# EAGLE design BUZZER (EAGLE 9.6.2)
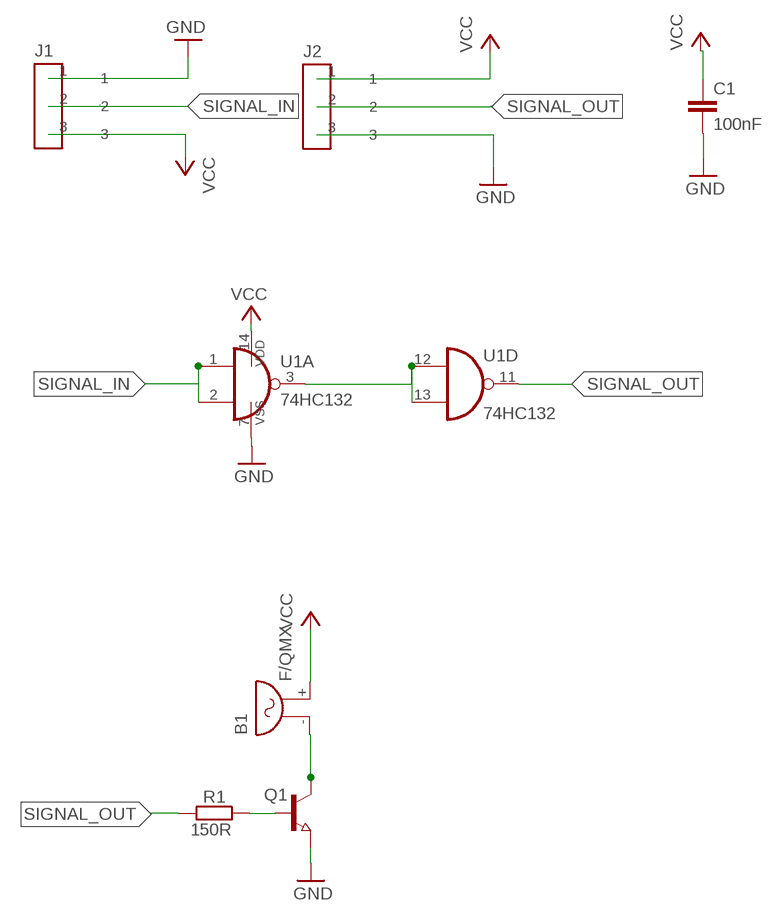
[diagram p0: schematic, sheet 1]

## Parts
B1  F/QMX  [F/QMX]
C1  100nF  C-EUC0805  [C0805]
J1  CONECTOR_MACHO  [MALE]
J2  CONECTOR_FEMEA  [FEMALE]
Q1  BC817  NPN-TRANSISTOR_SOT23  [SOT23]
R1  150R  R-EU_R0805W  [R0805W]
U1  74HC132  4011D  [SO14]

## Nets
GND: C1.2 J1.1 J2.3 Q1.2(E) U1.7(P:VSS)
N$1: U1.3(A:O) U1.12(D:I0) U1.13(D:I1)
N$2: Q1.1(B) R1.1
N$4: B1.- Q1.3(C)
SIGNAL_IN: J1.2 U1.1(A:I0) U1.2(A:I1)
SIGNAL_OUT: J2.2 R1.2 U1.11(D:O)
VCC: B1.+ C1.1 J1.3 J2.1 U1.14(P:VDD)
Unconnected: U1.4(B:O) U1.5(B:I0) U1.6(B:I1) U1.8(C:I0) U1.9(C:I1) U1.10(C:O)

## Library data of the parts
B1 = buzzer:F/QMX: BUZZER Source: Buerklin; OC_FARNELL: unknown; OC_NEWARK: unknown
C1 = rcl:C-EU: CAPACITOR, European symbol; SPICEPREFIX: C
J1 = Eletroblocks Lib:CONECTOR_MACHO
J2 = Eletroblocks Lib:CONECTOR_FEMEA
Q1 = semicon-smd-ipc:NPN-TRANSISTOR_: NPN TRANSISTOR
R1 = rcl:R-EU_: RESISTOR, European symbol; SPICEPREFIX: R
U1 = 40xx:4011: Quad 2-input NAND

## Board
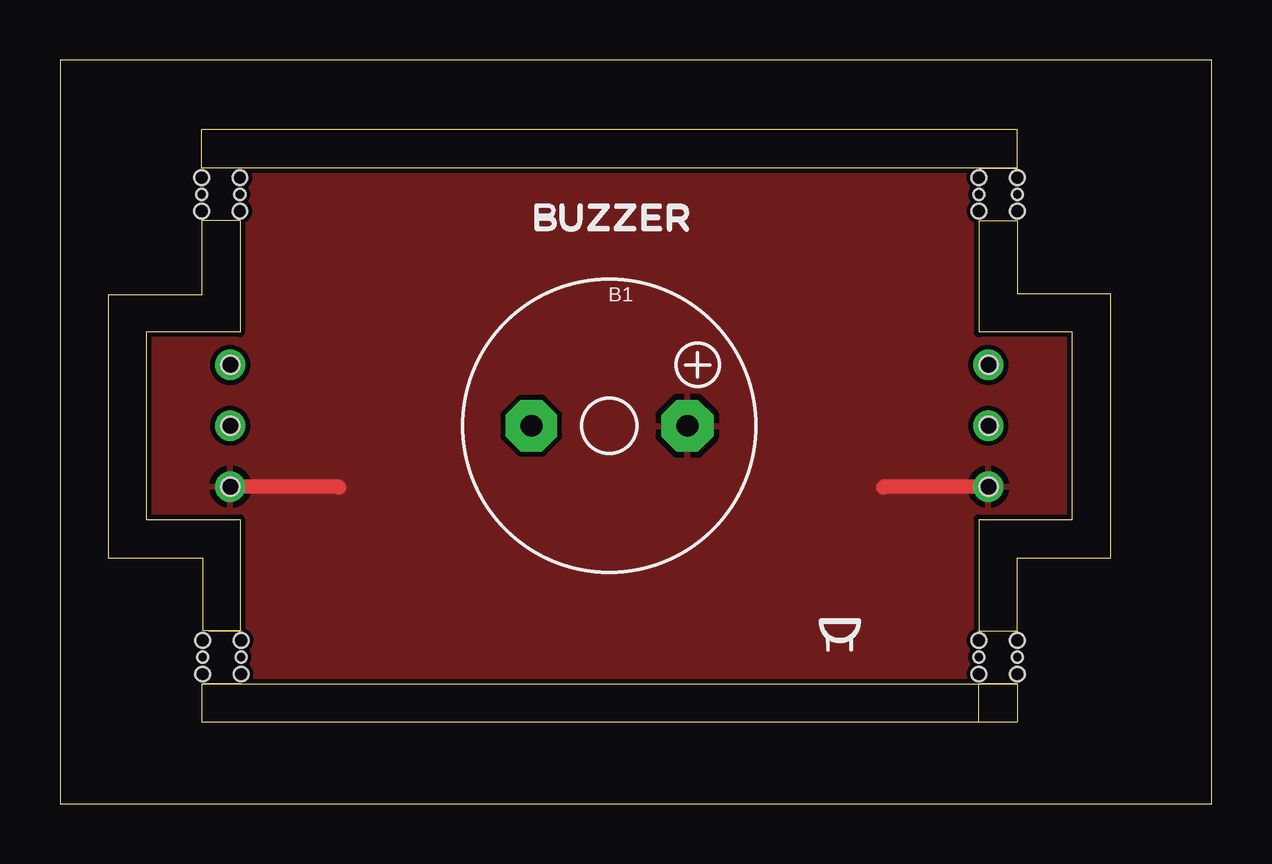
[diagram p1: board, top side]
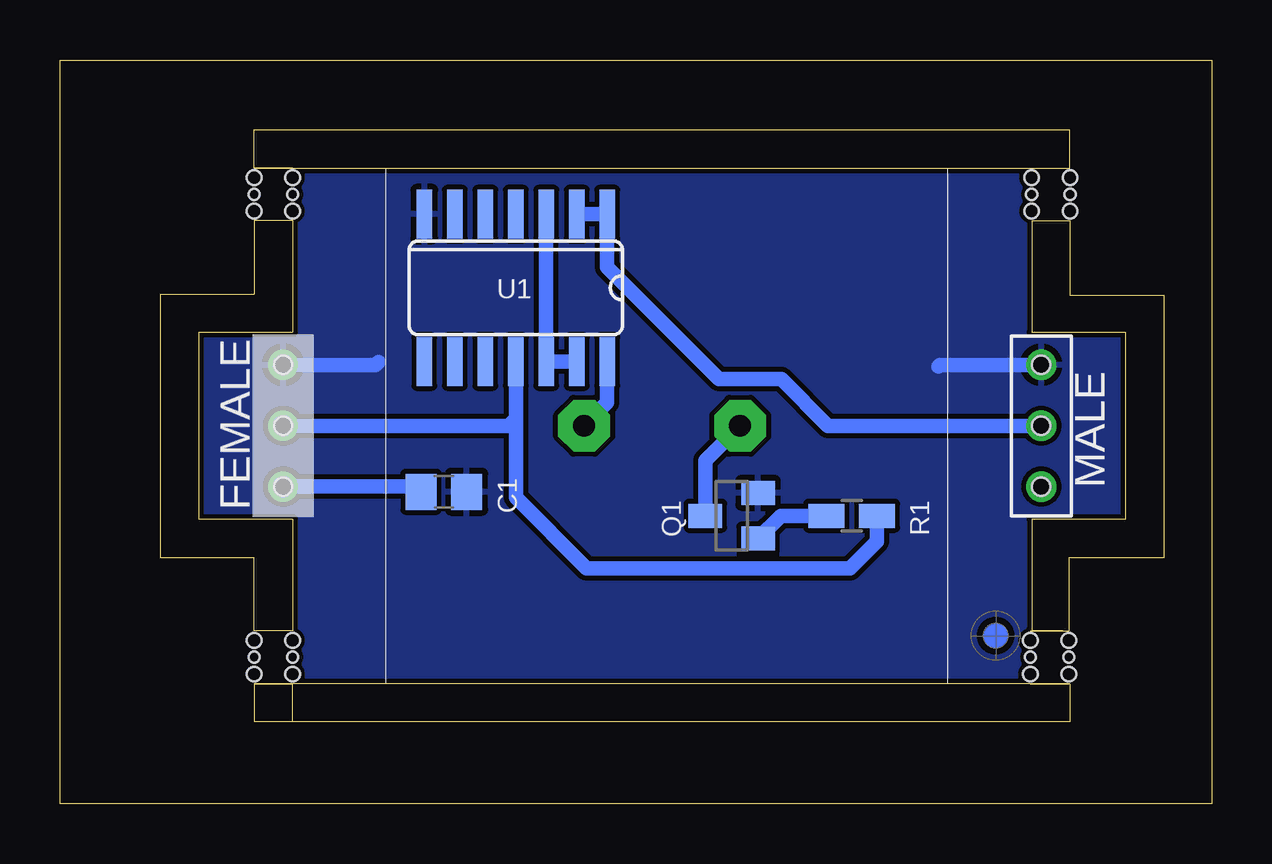
[diagram p2: board, bottom side, seen from below]

Size 48 x 31 mm. Coordinates in mm from the lower left corner, seen from the top.
Outline: 38.3,5 5.9,5 5.9,3.4 39.9,3.4 39.9,5 38.3,5
Outline: 38.3,3.4 38.3,5
Outline: 38.3,7.2 38.3,11.85 42.2,11.85 42.2,19.65 38.3,19.65 38.3,24.3
Outline: 39.9,7.2 39.9,10.25 43.8,10.25 43.8,21.25 39.9,21.25 39.9,24.3
Outline: 39.9,26.5 5.9,26.5 5.9,28.1 39.9,28.1 39.9,26.5
Outline: 7.5,19.65 3.6,19.65 3.6,11.85 7.5,11.85 7.5,7.2 6.2,7.2 5.95,7.2 5.95,10.25 2,10.25 2,21.2 5.9,21.2 5.9,24.3 7.5,24.3 7.5,19.65
Outline: 0,31 0,0 48,0 48,31 0,31
Copper layers (1*16): Top 0.035mm / dielectric 1.5mm / Bottom 0.035mm
Design rules "default *": minimum track width 8mil, minimum drill 0.35mm, track to track 8mil, track to pad 8mil, pad to pad 8mil, via to via 8mil, smd to smd 8mil, copper to edge 8mil, drill to drill 8mil, minimum pad ring 10mil, minimum via ring 8mil, stop-mask expansion 4mil, vias tented up to drill 0mil, thermal gap 10mil

### Footprints (pad centres in the part's own frame; a part is rotated, then mirrored left to right if it is on the bottom)
F/QMX = drill 0.914 pad 2.159 octagon: + 3.251,0; - -3.251,0
C0805 = smd 1.3 x 1.5: 1 -0.95,0; 2 0.95,0
MALE = drill 0.75: 1 0,2.54; 2 0,0; 3 0,-2.54 | hole 0.75: 0,2.54; 0,0; 0,-2.54
FEMALE = drill 0.75: 1 0,2.54; 2 0,0; 3 0,-2.54 | hole 0.75: 0,2.54; 0,0; 0,-2.54
SOT23 = smd 1 x 1.4: 1 -0.95,-1.1; 2 0.95,-1.1; 3 0,1.1
R0805W = smd 1.5 x 1: 1 -1.052,0; 2 1.052,0
SO14 = smd 0.66 x 2.032: 1 -3.81,-3.073; 2 -2.54,-3.073; 3 -1.27,-3.073; 4 0,-3.073; 5 1.27,-3.073; 6 2.54,-3.073; 7 3.81,-3.073; 8 3.81,3.073; 9 2.54,3.073; 10 1.27,3.073; 11 0,3.073; 12 -1.27,3.073; 13 -2.54,3.073; 14 -3.81,3.073
STAMP_DUPLO = hole 0.45: 0,0; 0,-1.6 | hole 0.6: 0.7,0; -0.7,0; 0.7,-1.6; -0.7,-1.6

### Placement (x,y rotation side)
B1  22.9,15.75 0 top
C1  32,13 0 bottom
J1  7.1,15.75 0 top
J2  38.7,15.75 180 top
Q1  20,12 90 bottom
R1  15,12 0 bottom
U1  29,21.5 180 bottom
U$1  [FIDUCIAL_G10]  9,7 0 bottom
U$2  [STAMP_DUPLO]  7.55,6.1 270 top
U$3  [STAMP_DUPLO]  38.3,6.1 90 top
U$4  [STAMP_DUPLO]  38.3,25.4 90 top
U$5  [STAMP_DUPLO]  7.5,25.4 270 top

### Tracks (layer width: path | path; a pad name or v marks a point on that pad's centre or on a via)
GND
  Bottom 0.61: J1.1 11.33,18.29 11.39,18.23 | J2.3 34.84,18.29 34.72,18.41
  pour Bottom: 2.9,5 42.87,5 42.87,26.5 2.9,26.5
N$1
  Bottom 0.61: U1.3 U1.12 U1.13
N$2
  Bottom 0.61: R1.1 17.95,12 Q1.1
N$4
  Bottom 0.61: B1.- 21.1,14.3 Q1.3
SIGNAL_IN
  Bottom 0.61: J1.2 15.99,15.75 17.93,17.69 20.52,17.69 25.19,22.36 U1.1 U1.2
SIGNAL_OUT
  Bottom 0.61: U1.11 29,16.06 | 29,16.06 29,12.76 26.04,9.8 15.07,9.8 13.95,10.92 R1.2 | J2.2 29.31,15.75 29,16.06
VCC
  Top 0.61: J1.3 11.6,13.21 11.63,13.18 | J2.1 34.36,13.21 34.33,13.18
  Bottom 0.61: J2.1 33.16,13.21 C1.1 | U1.14 25.19,16.71 B1.+
  pour Top: 2.97,4.86 2.97,26.48 42.95,26.48 42.95,5.05 3.16,5.05

### Text on the board
tStop: V1.0.3
bStop: V1.0.3